# Altium schematic sheet FPGA_SPARTAN_III.SchDoc
size A2; Organization: Altium Limited; Address1: L3, 12a Rodborough Rd; Address2: Frenchs Forest; Address3: NSW; Address4: Australia 2086; DocumentNumber: 8; SheetNumber: 8; SheetTotal: 10
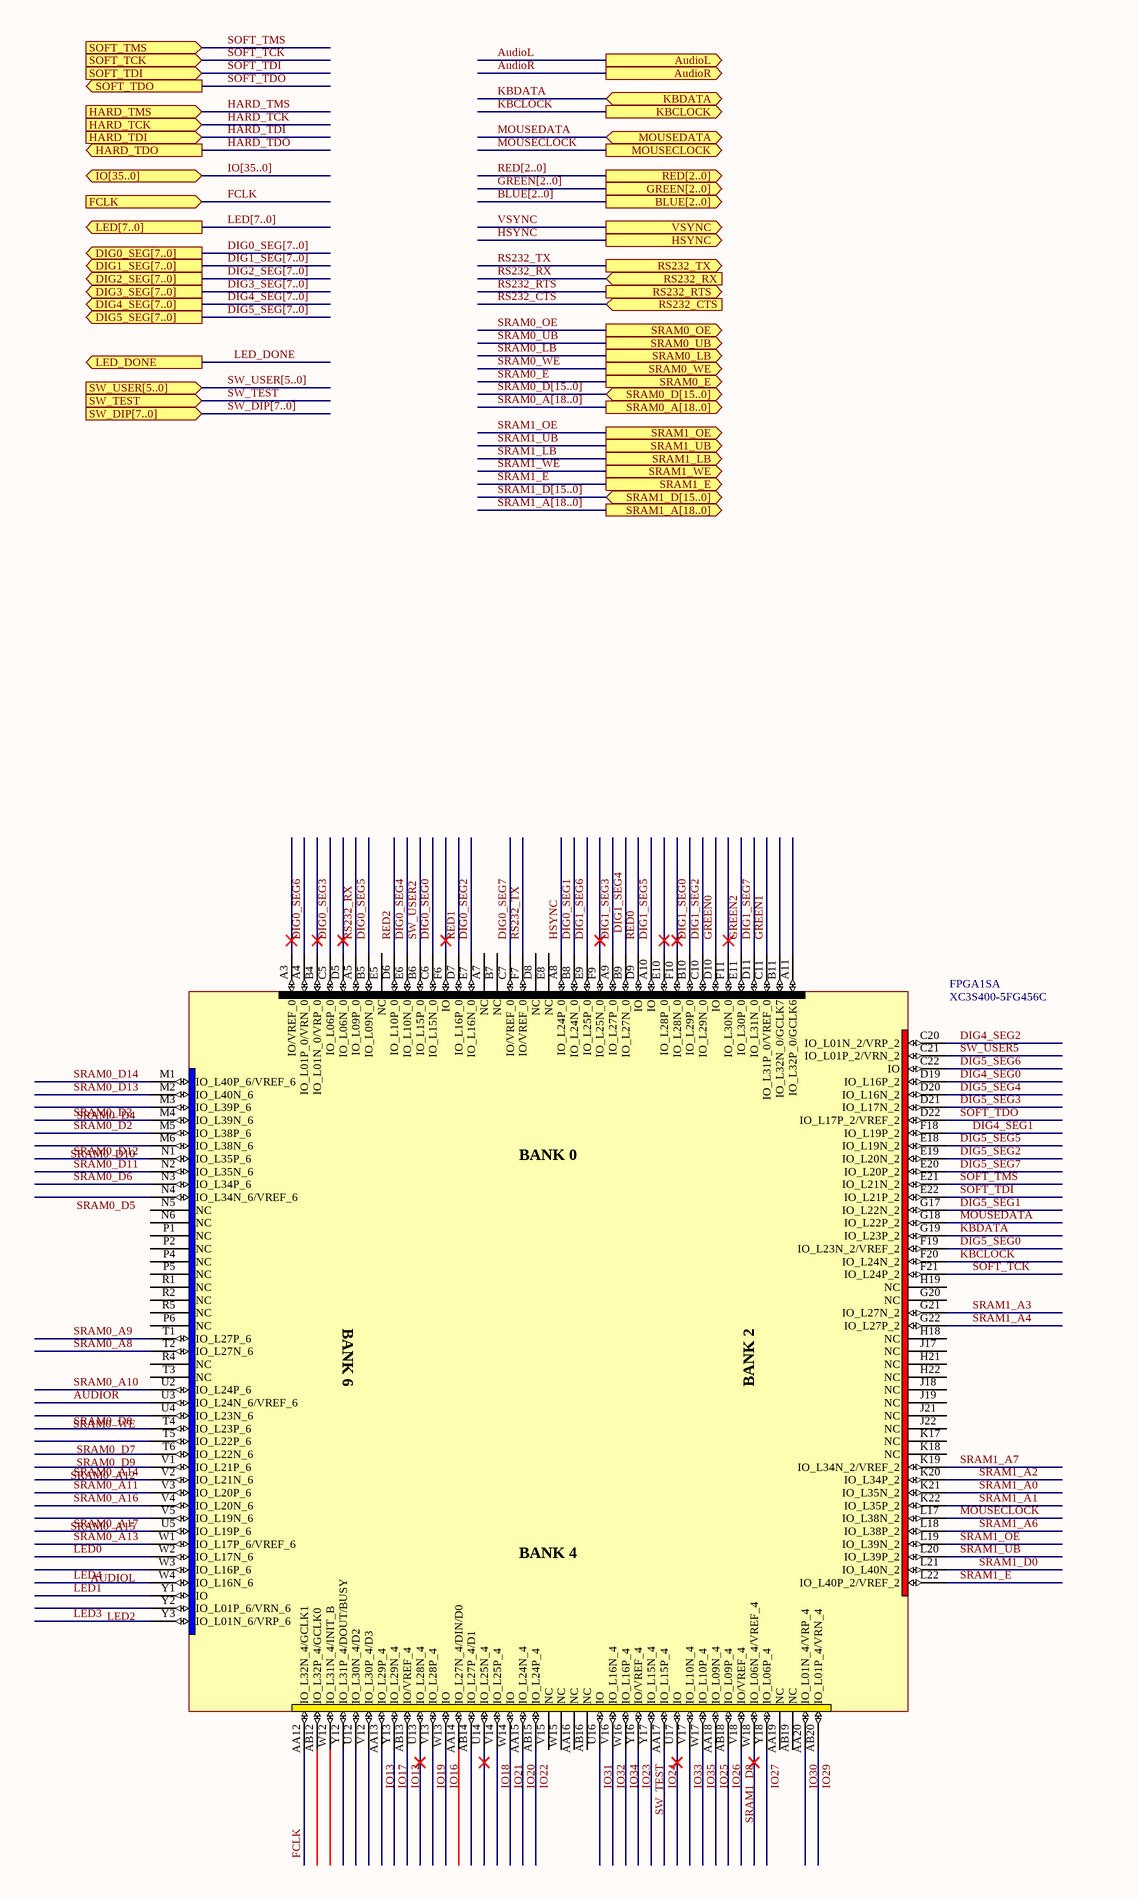
[diagram p0: FPGA_SPARTAN_III.SchDoc, left]
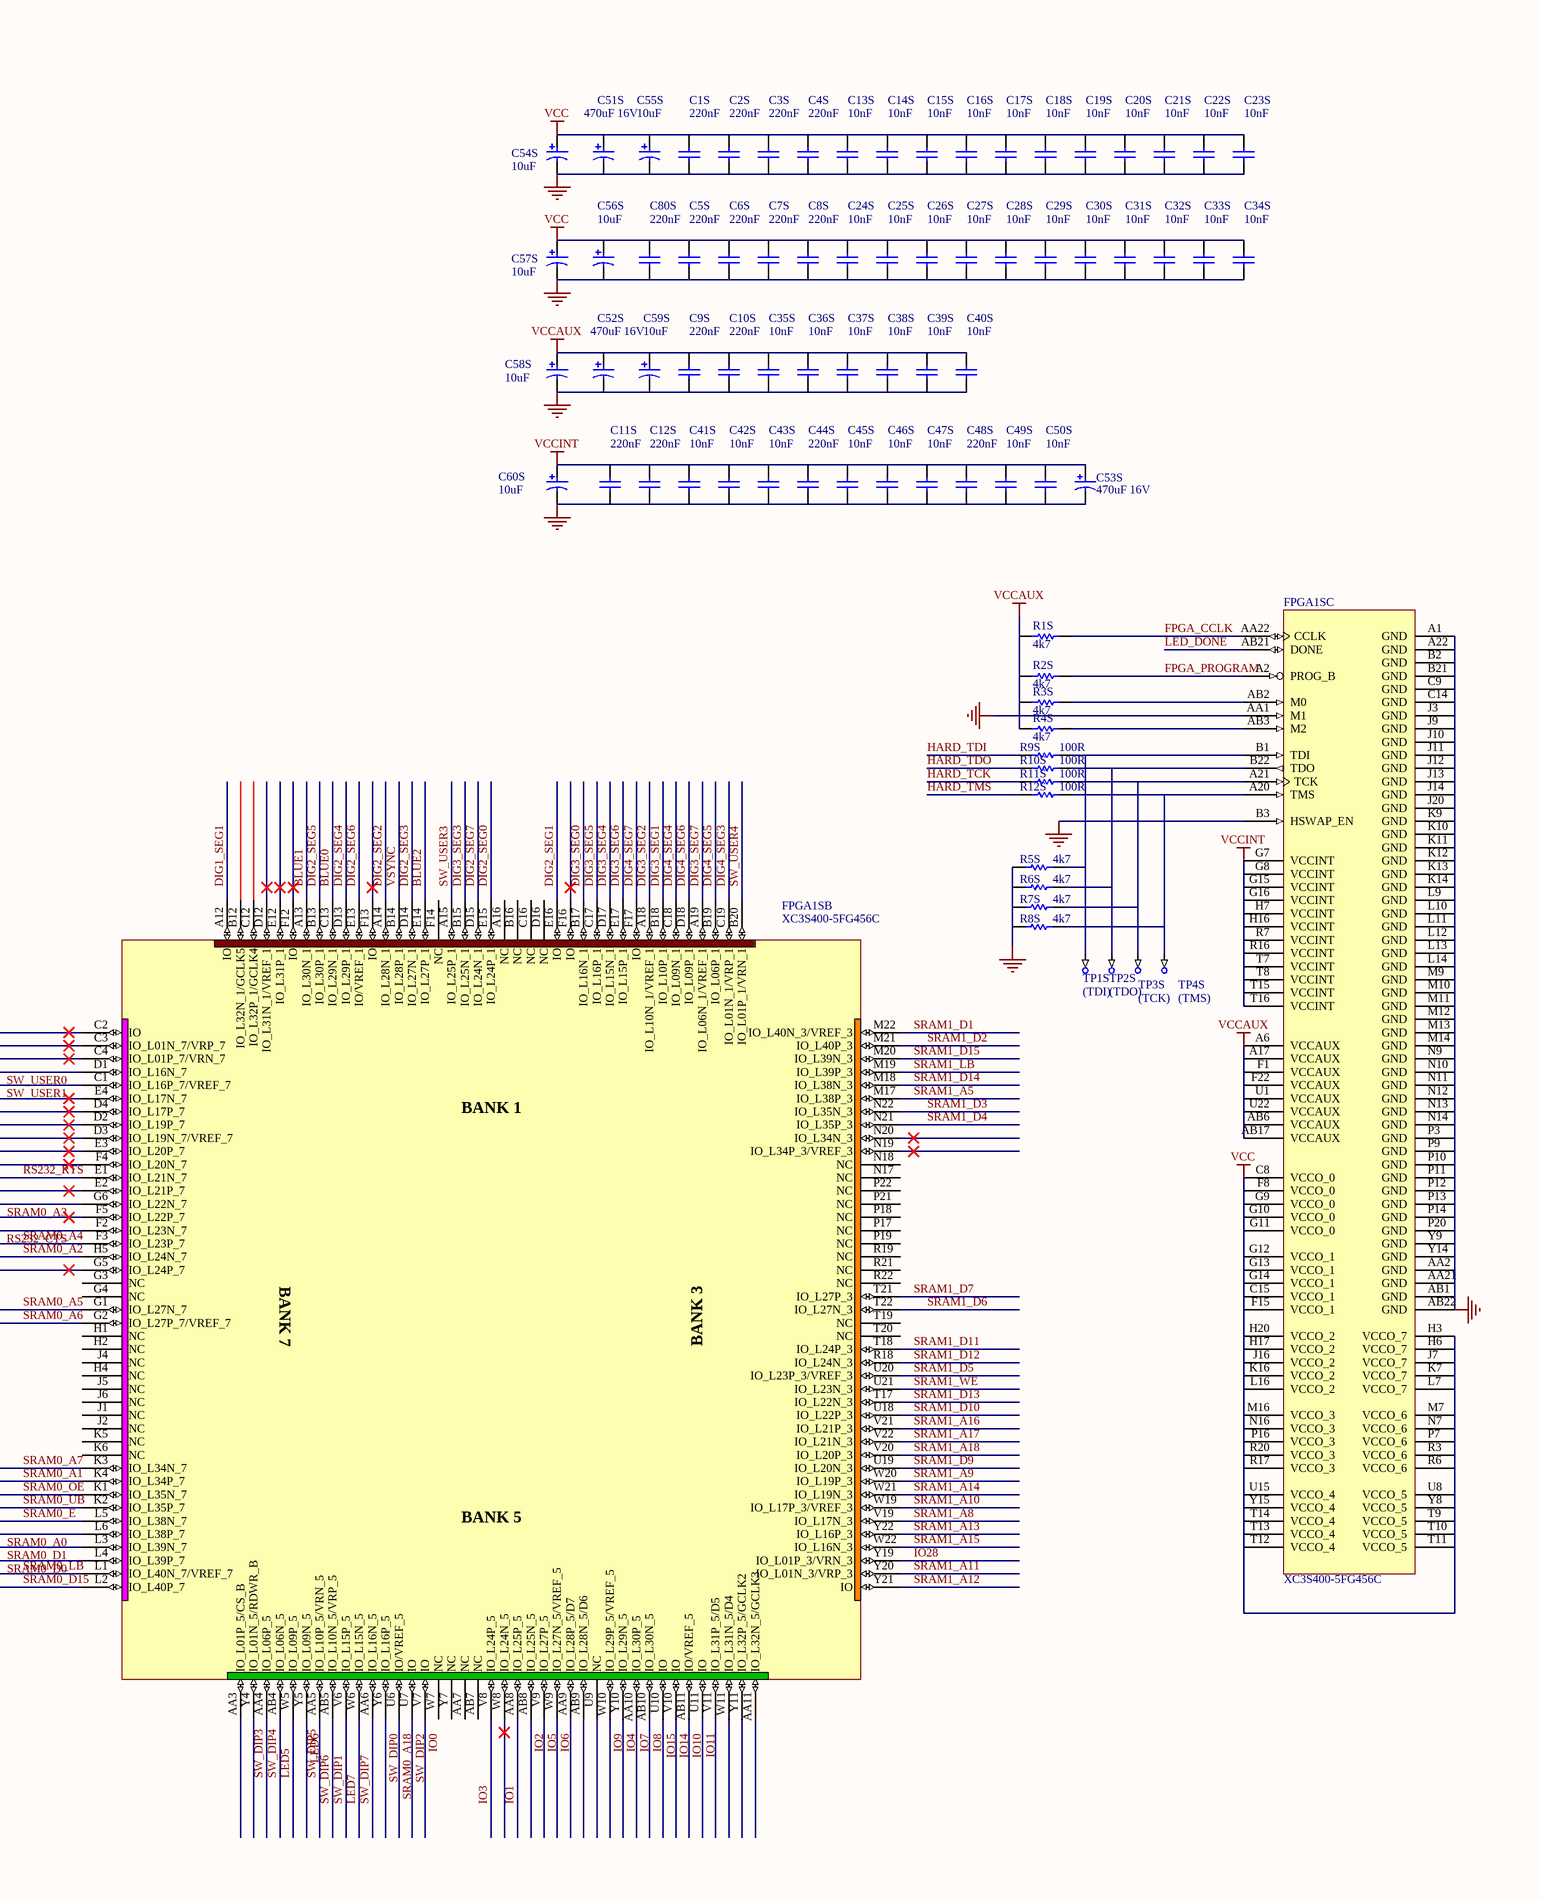
[diagram p1: FPGA_SPARTAN_III.SchDoc, right]

## Parts
C1S  220nF  [CC1608-0603]
C2S  220nF  [CC1608-0603]
C3S  220nF  [CC1608-0603]
C4S  220nF  [CC1608-0603]
C5S  220nF  [CC1608-0603]
C6S  220nF  [CC1608-0603]
C7S  220nF  [CC1608-0603]
C8S  220nF  [CC1608-0603]
C9S  220nF  [CC1608-0603]
C10S  220nF  [CC1608-0603]
C11S  220nF  [CC1608-0603]
C12S  220nF  [CC1608-0603]
C13S  10nF  [CC1608-0603]
C14S  10nF  [CC1608-0603]
C15S  10nF  [CC1608-0603]
C16S  10nF  [CC1608-0603]
C17S  10nF  [CC1608-0603]
C18S  10nF  [CC1608-0603]
C19S  10nF  [CC1608-0603]
C20S  10nF  [CC1608-0603]
C21S  10nF  [CC1608-0603]
C22S  10nF  [CC1608-0603]
C23S  10nF  [CC1608-0603]
C24S  10nF  [CC1608-0603]
C25S  10nF  [CC1608-0603]
C26S  10nF  [CC1608-0603]
C27S  10nF  [CC1608-0603]
C28S  10nF  [CC1608-0603]
C29S  10nF  [CC1608-0603]
C30S  10nF  [CC1608-0603]
C31S  10nF  [CC1608-0603]
C32S  10nF  [CC1608-0603]
C33S  10nF  [CC1608-0603]
C34S  10nF  [CC1608-0603]
C35S  10nF  [CC1608-0603]
C36S  10nF  [CC1608-0603]
C37S  10nF  [CC1608-0603]
C38S  10nF  [CC1608-0603]
C39S  10nF  [CC1608-0603]
C40S  10nF  [CC1608-0603]
C41S  10nF  [CC1608-0603]
C42S  10nF  [CC1608-0603]
C43S  10nF  [CC1608-0603]
C44S  220nF  [CC1608-0603]
C45S  10nF  [CC1608-0603]
C46S  10nF  [CC1608-0603]
C47S  10nF  [CC1608-0603]
C48S  220nF  [CC1608-0603]
C49S  10nF  [CC1608-0603]
C50S  10nF  [CC1608-0603]
C51S  470uF 16V  [RB8/3.5]
C52S  470uF 16V  [RB8/3.5]
C53S  470uF 16V  [RB8/3.5]
C54S  10uF  [MCCT-B]
C55S  10uF  [MCCT-B]
C56S  10uF  [MCCT-B]
C57S  10uF  [MCCT-B]
C58S  10uF  [MCCT-B]
C59S  10uF  [MCCT-B]
C60S  10uF  [MCCT-B]
C80S  220nF  [CC1608-0603]
FPGA1S  XC3S400-5FG456C  [FG456]  (parts A,B,C of 3)
R1S  4k7  [CR2012-0805]
R2S  4k7  [CR2012-0805]
R3S  4k7  [CR2012-0805]
R4S  4k7  [CR2012-0805]
R5S  4k7  [CR2012-0805]
R6S  4k7  [CR2012-0805]
R7S  4k7  [CR2012-0805]
R8S  4k7  [CR2012-0805]
R9S  100R  [CR2012-0805]
R10S  100R  [CR2012-0805]
R11S  100R  [CR2012-0805]
R12S  100R  [CR2012-0805]
TP1S  (TDI)  [TestPin]  (no BOM)
TP2S  (TDO)  [TestPin]  (no BOM)
TP3S  (TCK)  [TestPin]  (no BOM)
TP4S  (TMS)  [TestPin]  (no BOM)

## Ports
AudioL (out), AudioR (out), BLUE[2..0] (out), DIG0_SEG[7..0] (out), DIG1_SEG[7..0] (out), DIG2_SEG[7..0] (out), DIG3_SEG[7..0] (out), DIG4_SEG[7..0] (out), DIG5_SEG[7..0] (out), FCLK (in), GREEN[2..0] (out), HARD_TCK (in), HARD_TDI (in), HARD_TDO (out), HARD_TMS (in), HSYNC (out), IO[35..0] (bidir), KBCLOCK (out), KBDATA (bidir), LED[7..0] (out), LED_DONE (out), MOUSECLOCK (out), MOUSEDATA (bidir), RED[2..0] (out), RS232_CTS (in), RS232_RTS (out), RS232_RX (in), RS232_TX (out), SOFT_TCK (in), SOFT_TDI (in), SOFT_TDO (out), SOFT_TMS (in), SRAM0_A[18..0] (out), SRAM0_D[15..0] (bidir), SRAM0_E (out), SRAM0_LB (out), SRAM0_OE (out), SRAM0_UB (out), SRAM0_WE (out), SRAM1_A[18..0] (out), SRAM1_D[15..0] (bidir), SRAM1_E (out), SRAM1_LB (out), SRAM1_OE (out), SRAM1_UB (out), SRAM1_WE (out), SW_DIP[7..0] (in), SW_TEST (in), SW_USER[5..0] (in), VSYNC (out)

## Nets
GND: C1S.2 C2S.2 C3S.2 C4S.2 C5S.2 C6S.2 C7S.2 C8S.2 C9S.2 C10S.2 C11S.2 C12S.2 C13S.2 C14S.2 C15S.2 C16S.2 C17S.2 C18S.2 C19S.2 C20S.2 C21S.2 C22S.2 C23S.2 C24S.2 C25S.2 C26S.2 C27S.2 C28S.2 C29S.2 C30S.2 C31S.2 C32S.2 C33S.2 C34S.2 C35S.2 C36S.2 C37S.2 C38S.2 C39S.2 C40S.2 C41S.2 C42S.2 C43S.2 C44S.2 C45S.2 C46S.2 C47S.2 C48S.2 C49S.2 C50S.2 C51S.2 C52S.2 C53S.2 C54S.2 C55S.2 C56S.2 C57S.2 C58S.2 C59S.2 C60S.2 C80S.2 FPGA1S.A1(GND) FPGA1S.A22(GND) FPGA1S.AA1(M1) FPGA1S.AA2(GND) FPGA1S.AA21(GND) FPGA1S.AB1(GND) FPGA1S.AB22(GND) FPGA1S.B2(GND) FPGA1S.B3(HSWAP_EN) FPGA1S.B21(GND) FPGA1S.C9(GND) FPGA1S.C14(GND) FPGA1S.J3(GND) FPGA1S.J9(GND) FPGA1S.J10(GND) FPGA1S.J11(GND) FPGA1S.J12(GND) FPGA1S.J13(GND) FPGA1S.J14(GND) FPGA1S.J20(GND) FPGA1S.K9(GND) FPGA1S.K10(GND) FPGA1S.K11(GND) FPGA1S.K12(GND) FPGA1S.K13(GND) FPGA1S.K14(GND) FPGA1S.L9(GND) FPGA1S.L10(GND) FPGA1S.L11(GND) FPGA1S.L12(GND) FPGA1S.L13(GND) FPGA1S.L14(GND) FPGA1S.M9(GND) FPGA1S.M10(GND) FPGA1S.M11(GND) FPGA1S.M12(GND) FPGA1S.M13(GND) FPGA1S.M14(GND) FPGA1S.N9(GND) FPGA1S.N10(GND) FPGA1S.N11(GND) FPGA1S.N12(GND) FPGA1S.N13(GND) FPGA1S.N14(GND) FPGA1S.P3(GND) FPGA1S.P9(GND) FPGA1S.P10(GND) FPGA1S.P11(GND) FPGA1S.P12(GND) FPGA1S.P13(GND) FPGA1S.P14(GND) FPGA1S.P20(GND) FPGA1S.Y9(GND) FPGA1S.Y14(GND) R5S.1 R6S.1 R7S.1 R8S.1
VCC: C1S.1 C2S.1 C3S.1 C4S.1 C5S.1 C6S.1 C7S.1 C8S.1 C13S.1 C14S.1 C15S.1 C16S.1 C17S.1 C18S.1 C19S.1 C20S.1 C21S.1 C22S.1 C23S.1 C24S.1 C25S.1 C26S.1 C27S.1 C28S.1 C29S.1 C30S.1 C31S.1 C32S.1 C33S.1 C34S.1 C51S.1 C54S.1 C55S.1 C56S.1 C57S.1 C80S.1 FPGA1S.C8(VCCO_0) FPGA1S.C15(VCCO_1) FPGA1S.F8(VCCO_0) FPGA1S.F15(VCCO_1) FPGA1S.G9(VCCO_0) FPGA1S.G10(VCCO_0) FPGA1S.G11(VCCO_0) FPGA1S.G12(VCCO_1) FPGA1S.G13(VCCO_1) FPGA1S.G14(VCCO_1) FPGA1S.H3(VCCO_7) FPGA1S.H6(VCCO_7) FPGA1S.H17(VCCO_2) FPGA1S.H20(VCCO_2) FPGA1S.J7(VCCO_7) FPGA1S.J16(VCCO_2) FPGA1S.K7(VCCO_7) FPGA1S.K16(VCCO_2) FPGA1S.L7(VCCO_7) FPGA1S.L16(VCCO_2) FPGA1S.M7(VCCO_6) FPGA1S.M16(VCCO_3) FPGA1S.N7(VCCO_6) FPGA1S.N16(VCCO_3) FPGA1S.P7(VCCO_6) FPGA1S.P16(VCCO_3) FPGA1S.R3(VCCO_6) FPGA1S.R6(VCCO_6) FPGA1S.R17(VCCO_3) FPGA1S.R20(VCCO_3) FPGA1S.T9(VCCO_5) FPGA1S.T10(VCCO_5) FPGA1S.T11(VCCO_5) FPGA1S.T12(VCCO_4) FPGA1S.T13(VCCO_4) FPGA1S.T14(VCCO_4) FPGA1S.U8(VCCO_5) FPGA1S.U15(VCCO_4) FPGA1S.Y8(VCCO_5) FPGA1S.Y15(VCCO_4)
VCCAUX: C9S.1 C10S.1 C35S.1 C36S.1 C37S.1 C38S.1 C39S.1 C40S.1 C52S.1 C58S.1 C59S.1 FPGA1S.A6(VCCAUX) FPGA1S.A17(VCCAUX) FPGA1S.AB6(VCCAUX) FPGA1S.AB17(VCCAUX) FPGA1S.F1(VCCAUX) FPGA1S.F22(VCCAUX) FPGA1S.U1(VCCAUX) FPGA1S.U22(VCCAUX) R1S.1 R2S.1 R3S.1 R4S.1
VCCINT: C11S.1 C12S.1 C41S.1 C42S.1 C43S.1 C44S.1 C45S.1 C46S.1 C47S.1 C48S.1 C49S.1 C50S.1 C53S.1 C60S.1 FPGA1S.G7(VCCINT) FPGA1S.G8(VCCINT) FPGA1S.G15(VCCINT) FPGA1S.G16(VCCINT) FPGA1S.H7(VCCINT) FPGA1S.H16(VCCINT) FPGA1S.R7(VCCINT) FPGA1S.R16(VCCINT) FPGA1S.T7(VCCINT) FPGA1S.T8(VCCINT) FPGA1S.T15(VCCINT) FPGA1S.T16(VCCINT)
AudioL: FPGA1S.W3(IO_L16P_6) ; port AudioL
AudioR: FPGA1S.U3(IO_L24N_6/VREF_6) ; port AudioR
BLUE0: FPGA1S.C13(IO_L29N_1)
BLUE1: FPGA1S.A13(IO_L30N_1)
BLUE2: FPGA1S.E14(IO_L27P_1)
DIG0_SEG0: FPGA1S.C6(IO_L15N_0)
DIG0_SEG1: FPGA1S.B8(IO_L24N_0)
DIG0_SEG2: FPGA1S.E7(IO_L16N_0)
DIG0_SEG3: FPGA1S.C5(IO_L06P_0)
DIG0_SEG4: FPGA1S.E6(IO_L10N_0)
DIG0_SEG5: FPGA1S.B5(IO_L09N_0)
DIG0_SEG6: FPGA1S.A4(IO_L01P_0/VRN_0)
DIG0_SEG7: FPGA1S.C7(IO/VREF_0)
DIG1_SEG0: FPGA1S.B10(IO_L29P_0)
DIG1_SEG1: FPGA1S.A12(IO)
DIG1_SEG2: FPGA1S.C10(IO_L29N_0)
DIG1_SEG3: FPGA1S.A9(IO_L27P_0)
DIG1_SEG4: FPGA1S.B9(IO_L27N_0)
DIG1_SEG5: FPGA1S.A10(IO)
DIG1_SEG6: FPGA1S.E9(IO_L25P_0)
DIG1_SEG7: FPGA1S.D11(IO_L31N_0)
DIG2_SEG0: FPGA1S.E15(IO_L24P_1)
DIG2_SEG1: FPGA1S.E16(IO)
DIG2_SEG2: FPGA1S.A14(IO_L28N_1)
DIG2_SEG3: FPGA1S.D14(IO_L27N_1)
DIG2_SEG4: FPGA1S.D13(IO_L29P_1)
DIG2_SEG5: FPGA1S.B13(IO_L30P_1)
DIG2_SEG6: FPGA1S.E13(IO/VREF_1)
DIG2_SEG7: FPGA1S.D15(IO_L24N_1)
DIG3_SEG0: FPGA1S.B17(IO_L16N_1)
DIG3_SEG1: FPGA1S.B18(IO_L10P_1)
DIG3_SEG2: FPGA1S.A18(IO_L10N_1/VREF_1)
DIG3_SEG3: FPGA1S.B15(IO_L25N_1)
DIG3_SEG4: FPGA1S.D17(IO_L15N_1)
DIG3_SEG5: FPGA1S.C17(IO_L16P_1)
DIG3_SEG6: FPGA1S.E17(IO_L15P_1)
DIG3_SEG7: FPGA1S.A19(IO_L06N_1/VREF_1)
DIG4_SEG0: FPGA1S.D19(IO_L16P_2)
DIG4_SEG1: FPGA1S.F18(IO_L19P_2)
DIG4_SEG2: FPGA1S.C20(IO_L01N_2/VRP_2)
DIG4_SEG3: FPGA1S.C19(IO_L01N_1/VRP_1)
DIG4_SEG4: FPGA1S.C18(IO_L09N_1)
DIG4_SEG5: FPGA1S.B19(IO_L06P_1)
DIG4_SEG6: FPGA1S.D18(IO_L09P_1)
DIG4_SEG7: FPGA1S.F17(IO)
DIG5_SEG0: FPGA1S.F19(IO_L23N_2/VREF_2)
DIG5_SEG1: FPGA1S.G17(IO_L22N_2)
DIG5_SEG2: FPGA1S.E19(IO_L20N_2)
DIG5_SEG3: FPGA1S.D21(IO_L17N_2)
DIG5_SEG4: FPGA1S.D20(IO_L16N_2)
DIG5_SEG5: FPGA1S.E18(IO_L19N_2)
DIG5_SEG6: FPGA1S.C22(IO)
DIG5_SEG7: FPGA1S.E20(IO_L20P_2)
FCLK: FPGA1S.AA12(IO_L32N_4/GCLK1) ; port FCLK
FPGA_CCLK: FPGA1S.AA22(CCLK) R1S.2
FPGA_PROGRAM: FPGA1S.A2(PROG_B) R2S.2
GREEN0: FPGA1S.D10(IO)
GREEN1: FPGA1S.C11(IO_L31P_0/VREF_0)
GREEN2: FPGA1S.E11(IO_L30P_0)
HARD_TCK: R11S.1 ; port HARD_TCK
HARD_TDI: R9S.1 ; port HARD_TDI
HARD_TDO: R10S.1 ; port HARD_TDO
HARD_TMS: R12S.1 ; port HARD_TMS
HSYNC: FPGA1S.A8(IO_L24P_0) ; port HSYNC
IO0: FPGA1S.V7(IO)
IO1: FPGA1S.AA8(IO_L25P_5)
IO2: FPGA1S.AB8(IO_L25N_5)
IO3: FPGA1S.V8(IO_L24P_5)
IO4: FPGA1S.Y10(IO_L29N_5)
IO5: FPGA1S.V9(IO_L27P_5)
IO6: FPGA1S.W9(IO_L27N_5/VREF_5)
IO7: FPGA1S.AA10(IO_L30P_5)
IO8: FPGA1S.AB10(IO_L30N_5)
IO9: FPGA1S.W10(IO_L29P_5/VREF_5)
IO10: FPGA1S.AB11(IO/VREF_5)
IO11: FPGA1S.U11(IO)
IO12: FPGA1S.AB13(IO/VREF_4)
IO13: FPGA1S.AA13(IO_L29P_4)
IO14: FPGA1S.V10(IO)
IO15: FPGA1S.U10(IO)
IO16: FPGA1S.W13(IO)
IO17: FPGA1S.Y13(IO_L29N_4)
IO18: FPGA1S.V14(IO_L25P_4)
IO19: FPGA1S.V13(IO_L28P_4)
IO20: FPGA1S.AA15(IO_L24N_4)
IO21: FPGA1S.W14(IO)
IO22: FPGA1S.AB15(IO_L24P_4)
IO23: FPGA1S.Y16(IO/VREF_4)
IO24: FPGA1S.AA17(IO_L15P_4)
IO25: FPGA1S.AA18(IO_L09N_4)
IO26: FPGA1S.AB18(IO_L09P_4)
IO27: FPGA1S.Y18(IO_L06P_4)
IO28: FPGA1S.Y19(IO_L01P_3/VRN_3)
IO29: FPGA1S.AB20(IO_L01P_4/VRN_4)
IO30: FPGA1S.AA20(IO_L01N_4/VRP_4)
IO31: FPGA1S.U16(IO)
IO32: FPGA1S.V16(IO_L16N_4)
IO33: FPGA1S.V17(IO_L10N_4)
IO34: FPGA1S.W16(IO_L16P_4)
IO35: FPGA1S.W17(IO_L10P_4)
KBCLOCK: FPGA1S.F20(IO_L24N_2) ; port KBCLOCK
KBDATA: FPGA1S.G19(IO_L23P_2) ; port KBDATA
LED0: FPGA1S.W2(IO_L17N_6)
LED1: FPGA1S.Y1(IO)
LED2: FPGA1S.Y2(IO_L01P_6/VRN_6)
LED3: FPGA1S.Y3(IO_L01N_6/VRP_6)
LED4: FPGA1S.W4(IO_L16N_6)
LED5: FPGA1S.W5(IO_L09P_5)
LED6: FPGA1S.Y5(IO_L09N_5)
LED7: FPGA1S.W6(IO_L15N_5)
LED_DONE: FPGA1S.AB21(DONE) ; port LED_DONE
MOUSECLOCK: FPGA1S.L17(IO_L38N_2) ; port MOUSECLOCK
MOUSEDATA: FPGA1S.G18(IO_L22P_2) ; port MOUSEDATA
RED0: FPGA1S.D9(IO)
RED1: FPGA1S.D7(IO_L16P_0)
RED2: FPGA1S.D6(IO_L10P_0)
RS232_CTS: FPGA1S.F2(IO_L23N_7) ; port RS232_CTS
RS232_RTS: FPGA1S.E1(IO_L21N_7) ; port RS232_RTS
RS232_RX: FPGA1S.A5(IO_L09P_0) ; port RS232_RX
RS232_TX: FPGA1S.F7(IO/VREF_0) ; port RS232_TX
SOFT_TCK: FPGA1S.F21(IO_L24P_2) ; port SOFT_TCK
SOFT_TDI: FPGA1S.E22(IO_L21P_2) ; port SOFT_TDI
SOFT_TDO: FPGA1S.D22(IO_L17P_2/VREF_2) ; port SOFT_TDO
SOFT_TMS: FPGA1S.E21(IO_L21N_2) ; port SOFT_TMS
SRAM0_A0: FPGA1S.L6(IO_L38P_7)
SRAM0_A1: FPGA1S.K4(IO_L34P_7)
SRAM0_A2: FPGA1S.H5(IO_L24N_7)
SRAM0_A3: FPGA1S.G6(IO_L22N_7)
SRAM0_A4: FPGA1S.F3(IO_L23P_7)
SRAM0_A5: FPGA1S.G1(IO_L27N_7)
SRAM0_A6: FPGA1S.G2(IO_L27P_7/VREF_7)
SRAM0_A7: FPGA1S.K3(IO_L34N_7)
SRAM0_A8: FPGA1S.T2(IO_L27N_6)
SRAM0_A9: FPGA1S.T1(IO_L27P_6)
SRAM0_A10: FPGA1S.U2(IO_L24P_6)
SRAM0_A11: FPGA1S.V3(IO_L20P_6)
SRAM0_A12: FPGA1S.V1(IO_L21P_6)
SRAM0_A13: FPGA1S.W1(IO_L17P_6/VREF_6)
SRAM0_A14: FPGA1S.V2(IO_L21N_6)
SRAM0_A15: FPGA1S.V5(IO_L19N_6)
SRAM0_A16: FPGA1S.V4(IO_L20N_6)
SRAM0_A17: FPGA1S.U5(IO_L19P_6)
SRAM0_A18: FPGA1S.U6(IO/VREF_5)
SRAM0_D0: FPGA1S.L4(IO_L39P_7)
SRAM0_D1: FPGA1S.L3(IO_L39N_7)
SRAM0_D2: FPGA1S.M5(IO_L38P_6)
SRAM0_D3: FPGA1S.M4(IO_L39N_6)
SRAM0_D4: FPGA1S.M3(IO_L39P_6)
SRAM0_D5: FPGA1S.N4(IO_L34N_6/VREF_6)
SRAM0_D6: FPGA1S.N3(IO_L34P_6)
SRAM0_D7: FPGA1S.T5(IO_L22P_6)
SRAM0_D8: FPGA1S.T4(IO_L23P_6)
SRAM0_D9: FPGA1S.T6(IO_L22N_6)
SRAM0_D10: FPGA1S.M6(IO_L38N_6)
SRAM0_D11: FPGA1S.N2(IO_L35N_6)
SRAM0_D12: FPGA1S.N1(IO_L35P_6)
SRAM0_D13: FPGA1S.M2(IO_L40N_6)
SRAM0_D14: FPGA1S.M1(IO_L40P_6/VREF_6)
SRAM0_D15: FPGA1S.L2(IO_L40P_7)
SRAM0_E: FPGA1S.L5(IO_L38N_7) ; port SRAM0_E
SRAM0_LB: FPGA1S.L1(IO_L40N_7/VREF_7) ; port SRAM0_LB
SRAM0_OE: FPGA1S.K1(IO_L35N_7) ; port SRAM0_OE
SRAM0_UB: FPGA1S.K2(IO_L35P_7) ; port SRAM0_UB
SRAM0_WE: FPGA1S.U4(IO_L23N_6) ; port SRAM0_WE
SRAM1_A0: FPGA1S.K21(IO_L35N_2)
SRAM1_A1: FPGA1S.K22(IO_L35P_2)
SRAM1_A2: FPGA1S.K20(IO_L34P_2)
SRAM1_A3: FPGA1S.G21(IO_L27N_2)
SRAM1_A4: FPGA1S.G22(IO_L27P_2)
SRAM1_A5: FPGA1S.M17(IO_L38P_3)
SRAM1_A6: FPGA1S.L18(IO_L38P_2)
SRAM1_A7: FPGA1S.K19(IO_L34N_2/VREF_2)
SRAM1_A8: FPGA1S.V19(IO_L17N_3)
SRAM1_A9: FPGA1S.W20(IO_L19P_3)
SRAM1_A10: FPGA1S.W19(IO_L17P_3/VREF_3)
SRAM1_A11: FPGA1S.Y20(IO_L01N_3/VRP_3)
SRAM1_A12: FPGA1S.Y21(IO)
SRAM1_A13: FPGA1S.Y22(IO_L16P_3)
SRAM1_A14: FPGA1S.W21(IO_L19N_3)
SRAM1_A15: FPGA1S.W22(IO_L16N_3)
SRAM1_A16: FPGA1S.V21(IO_L21P_3)
SRAM1_A17: FPGA1S.V22(IO_L21N_3)
SRAM1_A18: FPGA1S.V20(IO_L20P_3)
SRAM1_D0: FPGA1S.L21(IO_L40N_2)
SRAM1_D1: FPGA1S.M22(IO_L40N_3/VREF_3)
SRAM1_D2: FPGA1S.M21(IO_L40P_3)
SRAM1_D3: FPGA1S.N22(IO_L35N_3)
SRAM1_D4: FPGA1S.N21(IO_L35P_3)
SRAM1_D5: FPGA1S.U20(IO_L23P_3/VREF_3)
SRAM1_D6: FPGA1S.T22(IO_L27N_3)
SRAM1_D7: FPGA1S.T21(IO_L27P_3)
SRAM1_D8: FPGA1S.V18(IO/VREF_4)
SRAM1_D9: FPGA1S.U19(IO_L20N_3)
SRAM1_D10: FPGA1S.U18(IO_L22P_3)
SRAM1_D11: FPGA1S.T18(IO_L24P_3)
SRAM1_D12: FPGA1S.R18(IO_L24N_3)
SRAM1_D13: FPGA1S.T17(IO_L22N_3)
SRAM1_D14: FPGA1S.M18(IO_L38N_3)
SRAM1_D15: FPGA1S.M20(IO_L39N_3)
SRAM1_E: FPGA1S.L22(IO_L40P_2/VREF_2) ; port SRAM1_E
SRAM1_LB: FPGA1S.M19(IO_L39P_3) ; port SRAM1_LB
SRAM1_OE: FPGA1S.L19(IO_L39N_2) ; port SRAM1_OE
SRAM1_UB: FPGA1S.L20(IO_L39P_2) ; port SRAM1_UB
SRAM1_WE: FPGA1S.U21(IO_L23N_3) ; port SRAM1_WE
SW_DIP0: FPGA1S.Y6(IO_L16P_5)
SW_DIP1: FPGA1S.V6(IO_L15P_5)
SW_DIP2: FPGA1S.U7(IO)
SW_DIP3: FPGA1S.AA4(IO_L06P_5)
SW_DIP4: FPGA1S.AB4(IO_L06N_5)
SW_DIP5: FPGA1S.AA5(IO_L10P_5/VRN_5)
SW_DIP6: FPGA1S.AB5(IO_L10N_5/VRP_5)
SW_DIP7: FPGA1S.AA6(IO_L16N_5)
SW_TEST: FPGA1S.Y17(IO_L15N_4) ; port SW_TEST
SW_USER0: FPGA1S.D1(IO_L16N_7)
SW_USER1: FPGA1S.C1(IO_L16P_7/VREF_7)
SW_USER2: FPGA1S.B6(IO_L15P_0)
SW_USER3: FPGA1S.A15(IO_L25P_1)
SW_USER4: FPGA1S.B20(IO_L01P_1/VRN_1)
SW_USER5: FPGA1S.C21(IO_L01P_2/VRN_2)
VSYNC: FPGA1S.B14(IO_L28P_1) ; port VSYNC
NetFPGA1S_A20: FPGA1S.A20(TMS) R8S.2 R12S.2 TP4S.1
NetFPGA1S_A21: FPGA1S.A21(TCK) R7S.2 R11S.2 TP3S.1
NetFPGA1S_AB2: FPGA1S.AB2(M0) R3S.2
NetFPGA1S_AB3: FPGA1S.AB3(M2) R4S.2
NetFPGA1S_B1: FPGA1S.B1(TDI) R5S.2 R9S.2 TP1S.1
NetFPGA1S_B22: FPGA1S.B22(TDO) R6S.2 R10S.2 TP2S.1

Not connected (* = marked no-connect by the designer): FPGA1S A3(IO/VREF_0)* A7(NC) A11(IO_L32P_0/GCLK6) A16(NC) AA3(IO_L01P_5/CS_B) AA7(NC) AA9(IO_L28P_5/D7) AA11(IO_L32N_5/GCLK3) AA14(IO_L27N_4/DIN/D0) AA16(NC) AA19(NC) AB7(NC) AB9(IO_L28N_5/D6) AB12(IO_L32P_4/GCLK0) AB14(IO_L27P_4/D1) AB16(NC) AB19(NC) B4(IO_L01N_0/VRP_0)* B7(NC) B11(IO_L32N_0/GCLK7) B12(IO_L32N_1/GCLK5) B16(NC) C2(IO)* C3(IO_L01N_7/VRP_7)* C4(IO_L01P_7/VRN_7)* C12(IO_L32P_1/GCLK4) C16(NC) D2(IO_L19P_7)* D3(IO_L19N_7/VREF_7)* D4(IO_L17P_7)* D5(IO_L06N_0)* D8(NC) D12(IO_L31N_1/VREF_1)* D16(NC) E2(IO_L21P_7)* E3(IO_L20P_7)* E4(IO_L17N_7)* E5(NC) E8(NC) E10(IO_L28P_0)* E12(IO_L31P_1)* F4(IO_L20N_7)* F5(IO_L22P_7)* F6(IO)* F9(IO_L25N_0)* F10(IO_L28N_0)* F11(IO_L30N_0)* F12(IO)* F13(IO)* F14(NC) F16(IO)* G3(NC) G4(NC) G5(IO_L24P_7)* G20(NC) H1(NC) H2(NC) H4(NC) H18(NC) H19(NC) H21(NC) H22(NC) J1(NC) J2(NC) J4(NC) J5(NC) J6(NC) J17(NC) J18(NC) J19(NC) J21(NC) J22(NC) K5(NC) K6(NC) K17(NC) K18(NC) N5(NC) N6(NC) N17(NC) N18(NC) N19(IO_L34P_3/VREF_3)* N20(IO_L34N_3)* P1(NC) P2(NC) P4(NC) P5(NC) P6(NC) P17(NC) P18(NC) P19(NC) P21(NC) P22(NC) R1(NC) R2(NC) R4(NC) R5(NC) R19(NC) R21(NC) R22(NC) T3(NC) T19(NC) T20(NC) U9(NC) U12(IO_L30N_4/D2) U13(IO_L28N_4)* U14(IO_L25N_4)* U17(IO)* V11(IO_L31P_5/D5) V12(IO_L30P_4/D3) V15(NC) W7(NC) W8(IO_L24N_5)* W11(IO_L31N_5/D4) W12(IO_L31N_4/INIT_B) W15(NC) W18(IO_L06N_4/VREF_4)* Y4(IO_L01N_5/RDWR_B) Y7(NC) Y11(IO_L32P_5/GCLK2) Y12(IO_L31P_4/DOUT/BUSY)

## Buses and harness runs
bus BLUE[2..0] = port BLUE[2..0]
bus DIG0_SEG[7..0] = port DIG0_SEG[7..0]
bus DIG1_SEG[7..0] = port DIG1_SEG[7..0]
bus DIG2_SEG[7..0] = port DIG2_SEG[7..0]
bus DIG3_SEG[7..0] = port DIG3_SEG[7..0]
bus DIG4_SEG[7..0] = port DIG4_SEG[7..0]
bus DIG5_SEG[7..0] = port DIG5_SEG[7..0]
bus GREEN[2..0] = port GREEN[2..0]
bus IO[35..0] = port IO[35..0]
bus LED[7..0] = port LED[7..0]
bus RED[2..0] = port RED[2..0]
bus SRAM0_A[18..0] = port SRAM0_A[18..0]
bus SRAM0_D[15..0] = port SRAM0_D[15..0]
bus SRAM1_A[18..0] = port SRAM1_A[18..0]
bus SRAM1_D[15..0] = port SRAM1_D[15..0]
bus SW_DIP[7..0] = port SW_DIP[7..0]
bus SW_USER[5..0] = port SW_USER[5..0]

## Notes on the sheet
- Title
- Size:
- Date:
- File:
- A2
- Number:
- Time:
- Revision:
- Sheet
- of
- (in symbol XC3S400-5FG456C, part A) BANK 0; BANK 6; BANK 2; BANK 4
- (in symbol XC3S400-5FG456C, part B) BANK 1; BANK 7; BANK 3; BANK 5

## Library data of the parts
C1S C2S C3S C4S C5S C6S C7S C8S C9S C10S C11S C12S C13S C14S C15S C16S C17S C18S C19S C20S C21S C22S C23S C24S C25S C26S C27S C28S C29S C30S C31S C32S C33S C34S C35S C36S C37S C38S C39S C40S C41S C42S C43S C44S C45S C46S C47S C48S C49S C50S C80S = CAP: Capacitor; Supplier: FARNELL
  C1S C2S C3S C4S C5S C6S C7S C8S C9S C10S C11S C12S C44S C48S C80S: Supplier Code: 335-2020
  C13S C14S C15S C16S C17S C18S C19S C20S C21S C22S C23S C24S C25S C26S C27S C28S C29S C30S C31S C32S C33S C34S C35S C36S C37S C38S C39S C40S C41S C42S C43S C45S C46S C47S C49S C50S: Supplier Code: 772-236
C51S C52S C53S = CAP_POLAR: Polar Capacitor; Fitted: True
C54S C55S C56S C57S C58S C59S C60S = CAP_POLAR: Polar Capacitor; Supplier: FARNELL; Supplier Code: 967-117
FPGA1S = XC3S400-5FG456C: Spartan-3 1.2V FPGA, 264 User I/Os, 456-ball FBGA, High Performance, Commercial Grade; Package Information: Latest Revision: ver1.1, Apr-2001; Code - JEDEC: MO-151-AAJ-1; Published: 17-Sep-2003; Datasheet: Latest Revision: Dec-2003; Package Reference: FG456; Publisher: Altium Limited
R1S R2S R3S R4S R5S R6S R7S R8S R9S R10S R11S R12S = RES: Resistor
TP1S TP2S TP3S TP4S = TestPin